# EAGLE board CurrentController (EAGLE 6.6.0)
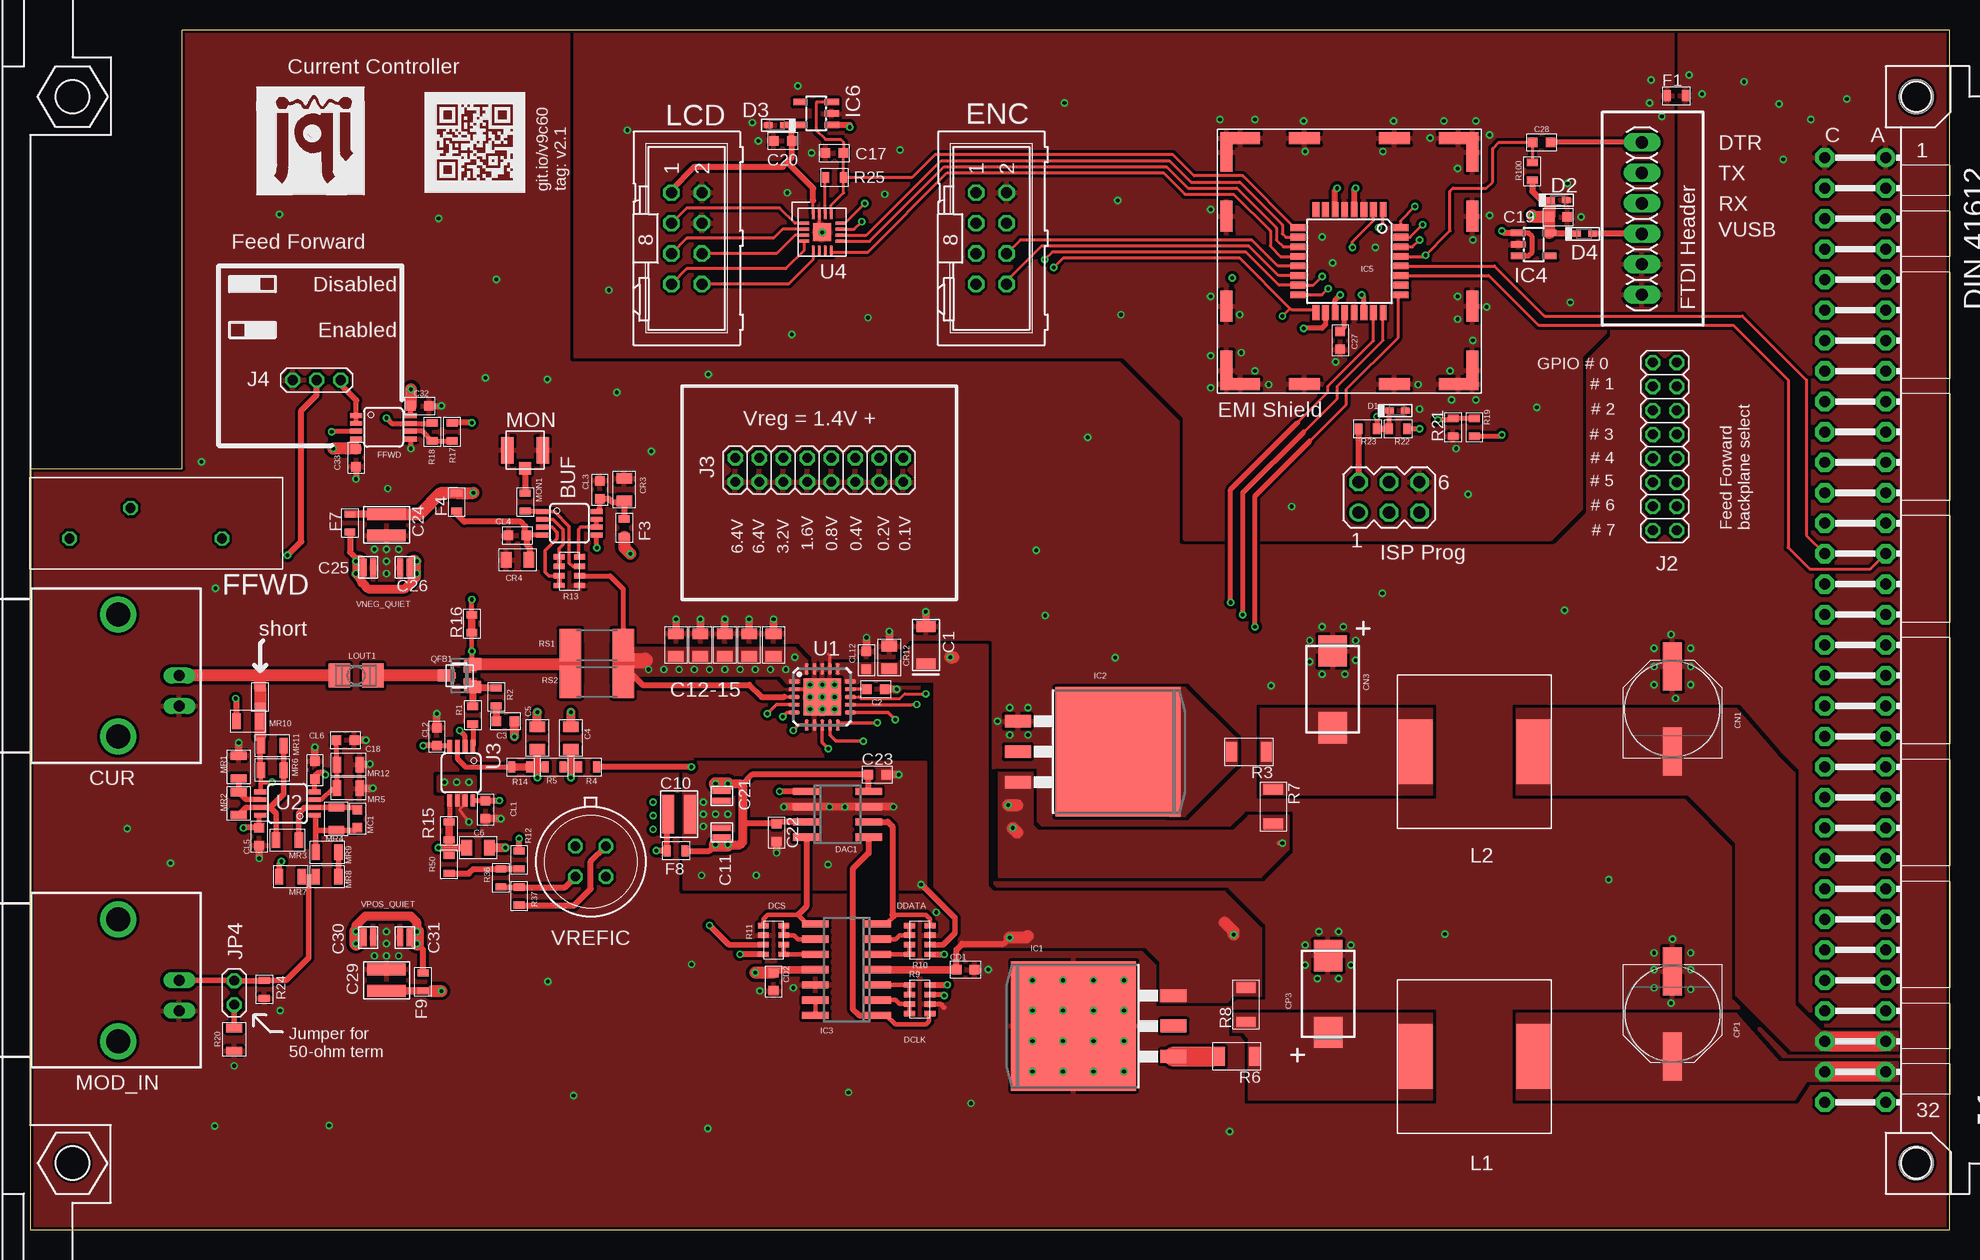
[diagram p5: board, top side]
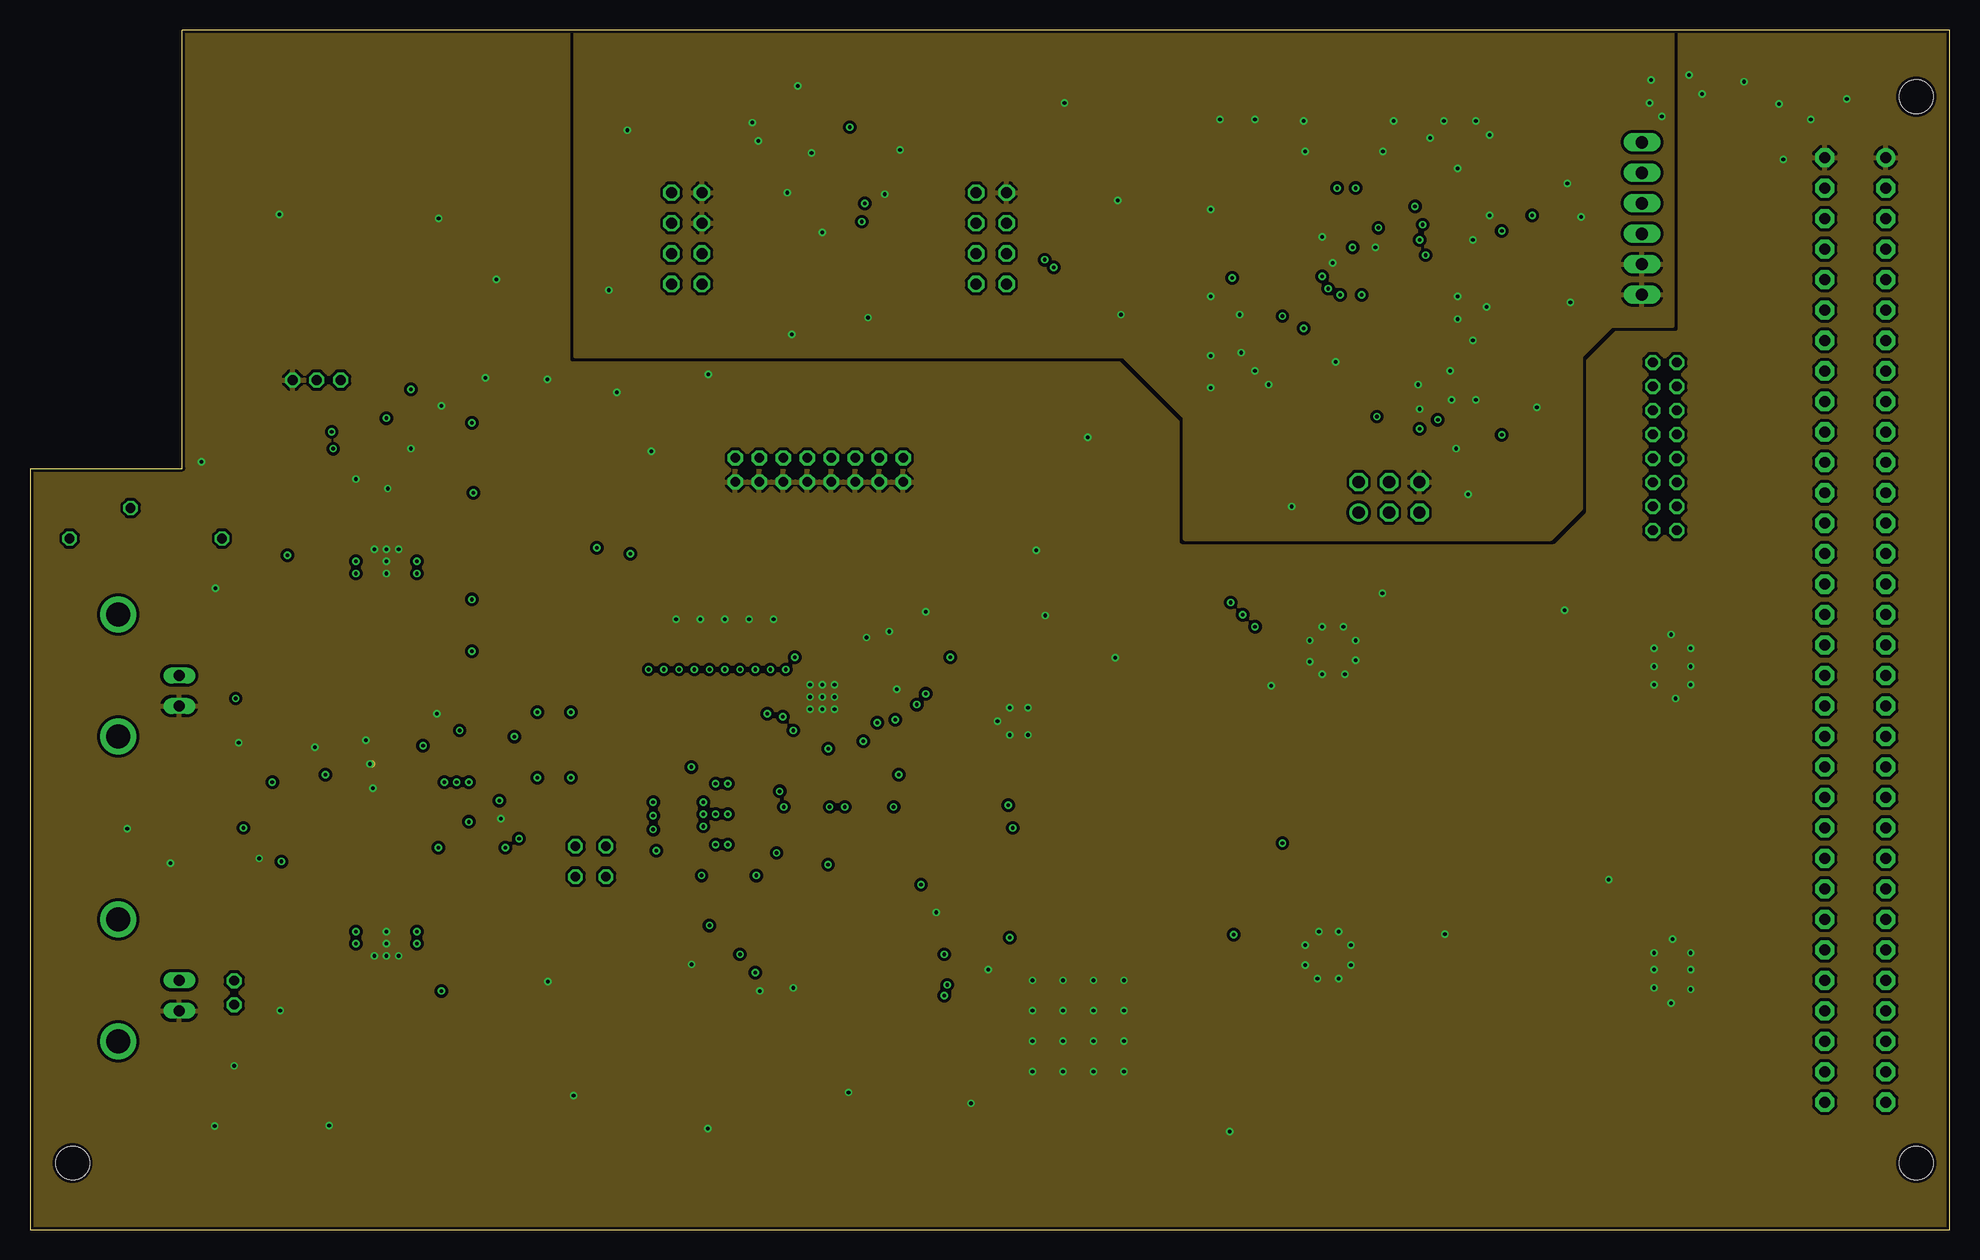
[diagram p6: board, inner layer Route2]
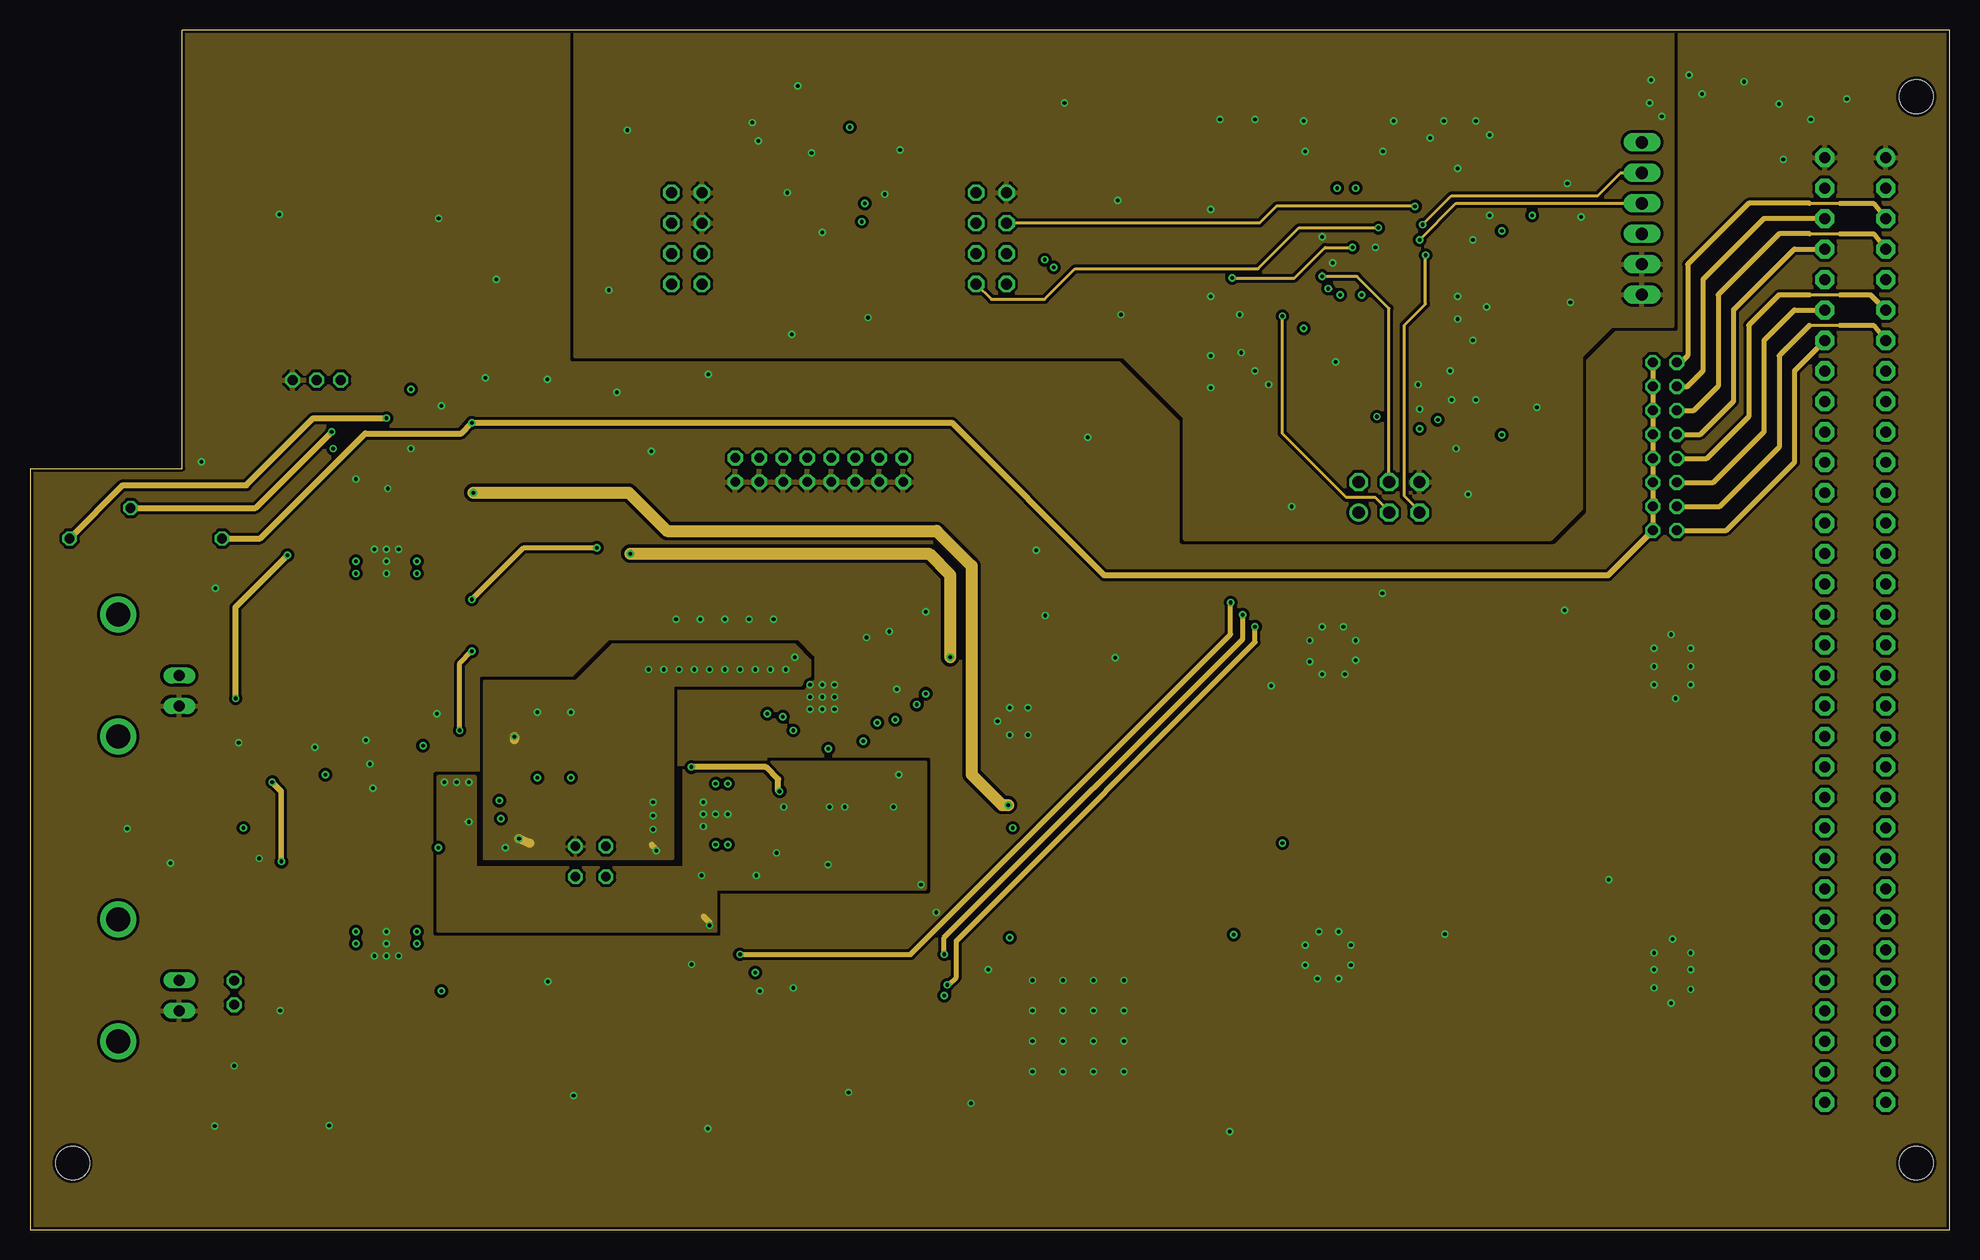
[diagram p7: board, inner layer Route15]
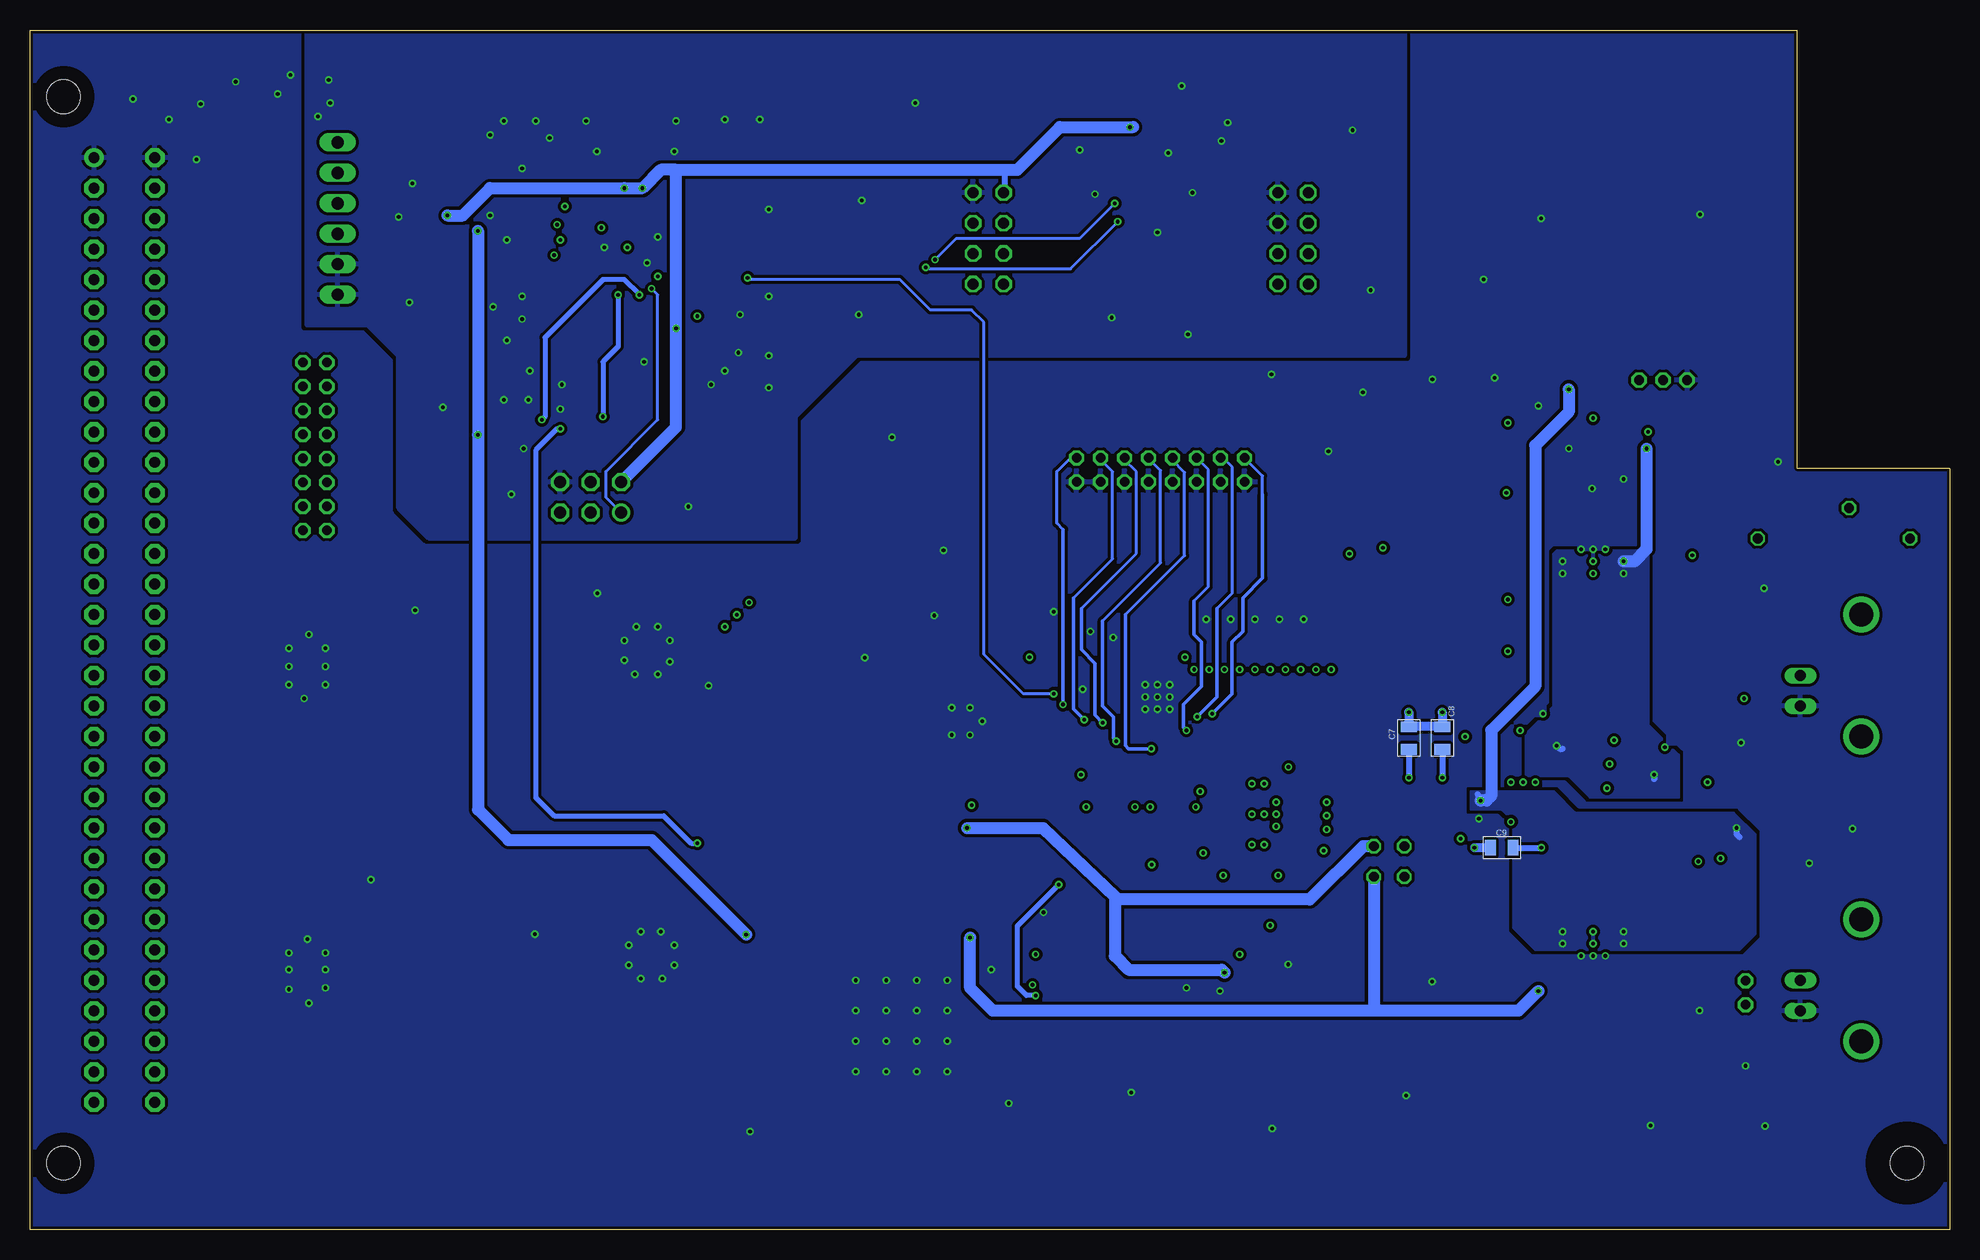
[diagram p8: board, bottom side, seen from below]

Size 160.02 x 100.03 mm. Coordinates in mm from the lower left corner, seen from the top.
Copper layers (1*2*15*16): Top 0.035mm / dielectric 0.23mm / Route2 0.035mm / dielectric 0.93mm / Route15 0.035mm / dielectric 0.23mm / Bottom 0.035mm
Design rules "MF_Standard_4_Layer": minimum track width 5mil, minimum drill 12mil, track to track 5mil, track to pad 5mil, pad to pad 5mil, via to via 5mil, smd to smd 0mil, copper to edge 10mil, drill to drill 10mil, minimum pad ring 6mil, minimum via ring 6mil, stop-mask expansion 2mil, vias tented up to drill 25mil, thermal gap 10mil

## Footprints (pad centres in the part's own frame; a part is rotated, then mirrored left to right if it is on the bottom)
MSOP08 = smd 0.4 x 1: 1 -0.976,-2.263; 2 -0.326,-2.263; 3 0.324,-2.263; 4 0.974,-2.263; 5 0.974,2.262; 6 0.324,2.262; 7 -0.326,2.262; 8 -0.976,2.262
C_POL_1206 = smd 0.9 x 1.6: P$1 -1.55,0; P$2 1.55,0
C_MLCC_0603 = smd 0.8 x 0.8: P$1 -0.75,0; P$2 0.75,0
C_MLCC_0805 = smd 0.9 x 1.3: P$1 -0.95,0; P$2 0.95,0
C_MLCC_0612 = smd 1 x 3.2: P$1 -0.9,0; P$2 0.9,0
C_MLCC_0306 = smd 0.5 x 1.5: P$1 -0.4,0; P$2 0.4,0
PANASONIC_F = smd 4 x 1.6: + 3.55,0; - -3.55,0
CT7343 = smd 2.6 x 2.4: + -3.2,0; - 3.2,0
BNC90 = drill 0.9 pad 1.27 long: 1 0,-5.08; 2 -2.54,-5.08 | drill 2 pad 2.032: ANCHOR1 -5.08,0; ANCHOR2 5.08,0
SOD523 = smd 0.7 x 0.5: A 0.7,0; C -0.6,0
SOIC-8 = smd 0.6 x 2.2: 1 -1.905,-2.6; 2 -0.635,-2.6; 3 0.635,-2.6; 4 1.905,-2.6; 5 1.905,2.6; 6 0.635,2.6; 7 -0.635,2.6; 8 -1.905,2.6
ML08 = drill 0.914 octagon: 1 -3.81,-1.143; 2 -3.81,1.397; 3 -1.27,-1.143; 4 -1.27,1.397; 5 1.27,-1.143; 6 1.27,1.397; 7 3.81,-1.143; 8 3.81,1.397
L_FERRITE_0603 = smd 0.6 x 0.9: P$1 -0.75,0; P$2 0.75,0
TO263-3 = smd 1.067 x 2.159: 1 -2.54,-5.791; 2 0,-5.791; 3 2.54,-5.791 | smd 10.8 x 10.41: TAB 0,2.54
TO223-3 = smd 1.067 x 2.159: 1 -2.54,-7.061; 2 0,-7.061; 3 2.54,-7.061 | smd 10.8 x 10.41: TAB 0,1.27
SO14 = smd 0.6 x 2.2: 1 -3.81,-2.6; 2 -2.54,-2.6; 3 -1.27,-2.6; 4 0,-2.6; 5 1.27,-2.6; 6 2.54,-2.6; 7 3.81,-2.6; 8 3.81,2.6; 9 2.54,2.6; 10 1.27,2.6; 11 0,2.6; 12 -1.27,2.6; 13 -2.54,2.6; 14 -3.81,2.6
SOT23-5L = smd 0.55 x 1.2: 1 -0.95,-1.3; 2 0,-1.3; 3 0.95,-1.3; 4 0.95,1.3; 5 -0.95,1.3
TQFP32-08 = smd 1.27 x 0.559: 1 -4.293,2.8; 2 -4.293,2; 3 -4.293,1.2; 4 -4.293,0.4; 5 -4.293,-0.4; 6 -4.293,-1.2; 7 -4.293,-2; 8 -4.293,-2.8; 17 4.293,-2.8; 18 4.293,-2; 19 4.293,-1.2; 20 4.293,-0.4; 21 4.293,0.4; 22 4.293,1.2; 23 4.293,2; 24 4.293,2.8 | smd 0.559 x 1.27: 9 -2.8,-4.293; 10 -2,-4.293; 11 -1.2,-4.293; 12 -0.4,-4.293; 13 0.4,-4.293; 14 1.2,-4.293; 15 2,-4.293; 16 2.8,-4.293; 25 2.8,4.293; 26 2,4.293; 27 1.2,4.293; 28 0.4,4.293; 29 -0.4,4.293; 30 -1.2,4.293; 31 -2,4.293; 32 -2.8,4.293
SOT323 = smd 0.5 x 1: 1 -0.65,-0.9; 2 0.65,-0.9; 3 0,0.9
SC-89 = smd 0.5 x 0.6: P$1 -0.5,-0.65; P$2 0.5,-0.65; P$3 0,0.65
VG64-CUTOUT = drill 0.914 pad 1.6: A1 154.94,35.56 | drill 0.914 pad 1.6 octagon: A2 154.94,33.02; A3 154.94,30.48; A4 154.94,27.94; A5 154.94,25.4; A6 154.94,22.86; A7 154.94,20.32; A8 154.94,17.78; A9 154.94,15.24; A10 154.94,12.7; A11 154.94,10.16; A12 154.94,7.62; A13 154.94,5.08; A14 154.94,2.54; A15 154.94,0; A16 154.94,-2.54; A17 154.94,-5.08; A18 154.94,-7.62; A19 154.94,-10.16; A20 154.94,-12.7; A21 154.94,-15.24; A22 154.94,-17.78; A23 154.94,-20.32; A24 154.94,-22.86; A25 154.94,-25.4; A26 154.94,-27.94; A27 154.94,-30.48; A28 154.94,-33.02; A29 154.94,-35.56; A30 154.94,-38.1; A31 154.94,-40.64; A32 154.94,-43.18; C1 149.86,35.56; C2 149.86,33.02; C3 149.86,30.48; C4 149.86,27.94; C5 149.86,25.4; C6 149.86,22.86; C7 149.86,20.32; C8 149.86,17.78; C9 149.86,15.24; C10 149.86,12.7; C11 149.86,10.16; C12 149.86,7.62; C13 149.86,5.08; C14 149.86,2.54; C15 149.86,0; C16 149.86,-2.54; C17 149.86,-5.08; C18 149.86,-7.62; C19 149.86,-10.16; C20 149.86,-12.7; C21 149.86,-15.24; C22 149.86,-17.78; C23 149.86,-20.32; C24 149.86,-22.86; C25 149.86,-25.4; C26 149.86,-27.94; C27 149.86,-30.48; C28 149.86,-33.02; C29 149.86,-35.56; C30 149.86,-38.1; C31 149.86,-40.64; C32 149.86,-43.18 | hole 2.794: 3.81,-48.26; 157.48,40.64; 157.48,-48.26
2X8_LOW_PROFILE_JUMPER_MATRIX = drill 0.8 pad 1.27 octagon: P$1 -7,-1; P$2 -7,1; P$3 -5,-1; P$4 -5,1; P$5 -3,-1; P$6 -3,1; P$7 -1,-1; P$8 -1,1; P$9 1,-1; P$10 1,1; P$11 3,-1; P$12 3,1; P$13 5,-1; P$14 5,1; P$15 7,-1; P$16 7,1
1X3_LOW_PROFILE = drill 0.8 pad 1.27 octagon: P1 0,1; P2 0,-1; P3 0,-3
1X06 = drill 1.016 long: 1 -6.35,0; 2 -3.81,0; 3 -1.27,0; 4 1.27,0; 5 3.81,0; 6 6.35,0
1X2_LOW_PROFILE = drill 0.8 pad 1.27 octagon: 1 0,-1; 2 0,1
WURTH_1280 = smd 5.4 x 2.9: P$1 0,4.95; P$2 0,-4.95
L3225P = smd 1.8 x 2: 1 -1.4,0; 2 1.4,0
UMC = smd 1.041 x 0.991: P$1 1.511,0 | smd 2.21 x 1.041: P$2 0,1.473; P$3 0,-1.473
R_0603 = smd 0.6 x 0.9: P$1 -0.75,0; P$2 0.75,0
R_0805 = smd 0.7 x 1.3: P$1 -0.95,0; P$2 0.95,0
SOT-23 = smd 1 x 1.4: 1 -0.95,-1.1; 2 0.95,-1.1; 3 0,1.1
R_1206 = smd 0.9 x 1.6: P$1 -1.45,0; P$2 1.45,0
742_ARRAY = smd 0.45 x 0.9: P$1 0,0.85; P$2 0,-0.85; P$3 0.8,0.85; P$4 0.8,-0.85; P$5 1.6,0.85; P$6 1.6,-0.85; P$7 2.4,0.85; P$8 2.4,-0.85
R2010 = smd 1.8 x 2.7: 1 -2.2,0; 2 2.2,0
MA03-2 = drill 1.016: 1 -2.54,-1.27 | drill 1.016 octagon: 2 -2.54,1.27; 3 0,-1.27; 4 0,1.27; 5 2.54,-1.27; 6 2.54,1.27
3006P = drill 0.8 octagon: P$1 -2.54,-7.62; P$2 0,0; P$3 -2.54,5.08
S-PVQFN-N20 = smd 0.9 x 0.3: 1 -2.35,1.3; 2 -2.35,0.65; 3 -2.35,0; 4 -2.35,-0.65; 5 -2.35,-1.3; 11 2.35,-1.3; 12 2.35,-0.65; 13 2.35,0; 14 2.35,0.65; 15 2.35,1.3 | smd 0.3 x 0.9: 6 -1.3,-2.35; 7 -0.65,-2.35; 8 0,-2.35; 9 0.65,-2.35; 10 1.3,-2.35; 16 1.3,2.35; 17 0.65,2.35; 18 0,2.35; 19 -0.65,2.35; 20 -1.3,2.35 | smd 3.1 x 3.1: EXP 0,0
HVQFN16 = smd 0.9 x 0.24: 1 -1.55,0.75; 2 -1.55,0.25; 3 -1.55,-0.25; 4 -1.55,-0.75; 9 1.55,-0.75; 10 1.55,-0.25; 11 1.55,0.25; 12 1.55,0.75 | smd 0.24 x 0.9: 5 -0.75,-1.55; 6 -0.25,-1.55; 7 0.25,-1.55; 8 0.75,-1.55; 13 0.75,1.55; 14 0.25,1.55; 15 -0.25,1.55; 16 -0.75,1.55 | smd 1.5 x 1.5: P$17 0,0
WURTH_SHIELD = smd 1 x 2.6: P$1 -10.25,3.75; P$2 -10.25,-3.75; P$3 10.25,3.75; P$4 10.25,-3.75 | smd 2.6 x 1: P$5 -3.75,-10.25; P$6 3.75,-10.25; P$7 3.75,10.25; P$8 -3.75,10.25 | smd 1 x 3.3: P$9 -10.25,-9.1; P$12 10.25,-9.1; P$13 10.25,9.1; P$16 -10.25,9.1 | smd 3.3 x 1: P$10 -9.1,-10.25; P$11 9.1,-10.25; P$14 9.1,10.25; P$15 -9.1,10.25
TO39/4 = drill 0.813 octagon: 1 -1.27,-1.27; 2 1.27,-1.27; 3 1.27,1.27; 4 -1.27,1.27

## Placement (x,y rotation side)
BUF  AD8676  [MSOP08]  44.96,58.9 270 top
C1  47uF  [C_POL_1206]  74.68,48.74 90 top
C2  1uF  [C_MLCC_0603]  70.51,45.07 0 top
C3  8.2nF  [C_MLCC_0603]  39.62,42.39 180 top
C4  22uF  [C_MLCC_0805]  45.09,41 270 top
C5  22uF  [C_MLCC_0805]  42.29,41 270 top
C6  22uF  [C_MLCC_0805]  37.34,31.85 180 top
C7  22uF  [C_MLCC_0805]  45.09,41 270 bottom
C8  22uF  [C_MLCC_0805]  42.29,41 270 bottom
C9  22uF  [C_MLCC_0805]  37.34,31.85 0 bottom
C10  0.47uF  [C_MLCC_0612]  54.1,34.65 0 top
C11  10nF  [C_MLCC_0306]  57.66,33.12 90 top
C12  10uF  [C_MLCC_0805]  61.98,48.74 90 top
C13  10uF  [C_MLCC_0805]  59.94,48.74 90 top
C14  10uF  [C_MLCC_0805]  57.91,48.74 90 top
C15  10uF  [C_MLCC_0805]  55.88,48.74 90 top
C16  10uF  [C_MLCC_0805]  53.85,48.74 90 top
C17  100nF  [C_MLCC_0603]  67.06,89.76 180 top
C18  1uF  [C_MLCC_0603]  26.29,40.82 180 top
C19  1uF  [C_MLCC_0603]  127.38,84.43 0 top
C20  1uF  [C_MLCC_0603]  62.74,90.78 180 top
C21  10nF  [C_MLCC_0306]  57.66,36.17 270 top
C22  100nF  [C_MLCC_0603]  62.23,33.12 270 top
C23  100nF  [C_MLCC_0603]  70.61,37.95 0 top
C24  0.47uF  [C_MLCC_0612]  29.72,58.78 270 top
C25  10nF  [C_MLCC_0306]  28.19,55.22 0 top
C26  10nF  [C_MLCC_0306]  31.24,55.22 180 top
C27  100nF  [C_MLCC_0603]  109.22,74.14 270 top
C28  100nF  [C_MLCC_0603]  125.98,90.65 180 top
C29  0.47uF  [C_MLCC_0612]  29.72,20.8 90 top
C30  10nF  [C_MLCC_0306]  28.19,24.36 0 top
C31  10nF  [C_MLCC_0306]  31.24,24.36 180 top
C32  100nF  [C_MLCC_0603]  32.51,68.68 0 top
C33  100nF  [C_MLCC_0603]  27.18,64.36 90 top
CD1  100nF  [C_MLCC_0603]  77.98,21.69 0 top
CD2  100nF  [C_MLCC_0603]  61.98,20.68 270 top
CL1  100nF  [C_MLCC_0603]  37.97,35.03 270 top
CL2  100nF  [C_MLCC_0603]  33.91,41.12 90 top
CL3  100nF  [C_MLCC_0603]  47.5,61.7 90 top
CL4  100nF  [C_MLCC_0603]  40.64,57.89 180 top
CL5  100nF  [C_MLCC_0603]  19.1,32.79 270 top
CL6  100nF  [C_MLCC_0603]  23.75,38.33 90 top
CL12  100nF  [C_MLCC_0603]  69.72,47.47 90 top
CN1  220uF  [PANASONIC_F]  136.91,43.41 90 top
CN3  47uF  [CT7343]  108.58,45.06 270 top
CP1  220uF  [PANASONIC_F]  136.91,18.01 270 top
CP3  47uF  [CT7343]  108.2,19.66 90 top
CR3  10uF  [C_MLCC_0805]  49.53,61.7 90 top
CR4  10uF  [C_MLCC_0805]  40.64,55.85 180 top
CR12  10uF  [C_MLCC_0805]  71.63,47.73 90 top
CUR  BNC-H  [BNC90]  7.37,46.2 90 top
D1  Schottky  [SOD523]  113.92,68.3 0 top
D2  Schottky  [SOD523]  127.36,85.83 0 top
D3  Schottky  [SOD523]  62.26,92.1 180 top
D4  Schottky  [SOD523]  129.54,83.03 0 top
DAC1  AD5541  [SOIC-8]  67.31,34.65 270 top
ENC  [ML08]  80.01,82.65 270 top
F1  1k_ferrite  [L_FERRITE_0603]  137.24,94.54 0 top
F3  1k_ferrite  [L_FERRITE_0603]  49.53,58.52 270 top
F4  1k_ferrite  [L_FERRITE_0603]  35.56,60.68 90 top
F7  1k_ferrite  [L_FERRITE_0603]  26.67,58.93 270 top
F8  1k_ferrite  [L_FERRITE_0603]  53.85,31.6 0 top
F9  1k_ferrite  [L_FERRITE_0603]  32.77,20.66 90 top
FFWD  AD8676  [MSOP08]  29.46,66.9 270 top
IC1  LM340S-12  [TO263-3]  89.53,16.99 90 top
IC2  L7912  [TO223-3]  89.41,39.85 270 top
IC3  TS514  [SO14]  68.07,21.69 90 top
IC4  MIC5205-5V  [SOT23-5L]  125.35,82.14 270 top
IC5  MEGA8-AI  [TQFP32-08]  109.98,80.75 270 top
IC6  MIC5205-3V  [SOT23-5L]  65.53,93.07 90 top
IC7  PMOS-SOT323  [SOT323]  35.81,46.2 90 top
IC8  PMOS-SOT323-SC89  [SC-89]  35.81,46.2 90 top
J1  [VG64-CUTOUT]  -0.25,53.82 0 top
J2  2X8_LOW_PROFILE_JUMPER  [2X8_LOW_PROFILE_JUMPER_MATRIX]  136.27,65.3 270 top
J3  2X8_LOW_PROFILE_JUMPER  [2X8_LOW_PROFILE_JUMPER_MATRIX]  65.79,63.35 0 top
J4  1X3_LOW_PROFILE_JUMPER  [1X3_LOW_PROFILE]  24.89,70.84 270 top
JP1  [1X06]  134.37,84.3 90 top
JP4  1X2_LOW_PROFILE_JUMPER  [1X2_LOW_PROFILE]  17.02,19.76 180 top
L1  100uH  [WURTH_1280]  120.4,14.45 270 top
L2  100uH  [WURTH_1280]  120.4,39.85 270 top
LCD  [ML08]  54.61,82.65 270 top
LOUT1  100uH  [L3225P]  27.18,46.2 180 top
MC1  1uF  [C_MLCC_0603]  27.3,34.26 270 top
MOD_IN  BNC-H  [BNC90]  7.37,20.8 90 top
MON  UMC  [UMC]  41.28,65 270 top
MON1  100R  [R_0603]  41.28,60.68 90 top
MR1  1k  [R_0805]  17.4,38.58 270 top
MR2  1k  [R_0805]  17.4,35.53 90 top
MR3  1k  [R_0805]  21.46,32.49 180 top
MR4  1k  [R_0805]  25.53,34.26 90 top
MR5  1k  [R_0805]  26.54,36.8 0 top
MR6  1k  [R_0805]  20.19,38.33 180 top
MR7  1k  [R_0805]  21.72,29.44 0 top
MR8  1k  [R_0805]  24.76,29.44 0 top
MR9  1k  [R_0805]  24.76,31.47 180 top
MR10  1k  [R_0805]  18.16,42.39 0 top
MR11  1k  [R_0805]  20.19,40.36 180 top
MR12  1k  [R_0805]  26.54,38.79 0 top
QFB1  NDS0605  [SOT-23]  35.81,46.2 90 top
R1  10k  [R_0603]  36.91,42.9 90 top
R2  100R  [R_0603]  38.86,44.42 270 top
R3  0R  [R_1206]  101.6,39.85 180 top
R4  3k  [R_0603]  46.48,38.58 0 top
R5  3k  [R_0603]  43.69,38.58 0 top
R6  0R  [R_1206]  100.58,14.45 180 top
R7  0R  [R_1206]  103.63,35.28 270 top
R8  0R  [R_1206]  101.35,18.77 90 top
R9  10k  [742_ARRAY]  74.17,20.42 270 top
R10  10k  [742_ARRAY]  74.17,22.96 90 top
R11  10k  [742_ARRAY]  61.98,22.96 90 top
R12  28.7k  [R_0603]  40.77,30.84 90 top
R13  10k  [742_ARRAY]  44.96,56.11 270 top
R14  [R_0603]  40.89,38.58 0 top
R15  [R_0603]  34.93,33.25 270 top
R16  [R_0603]  36.83,50.52 90 top
R17  10k  [R_0603]  35.18,66.52 270 top
R18  10k  [R_0603]  33.53,66.52 90 top
R19  28.7k  [R_0603]  120.4,66.9 270 top
R20  50R  [R_0805]  17.02,15.88 90 top
R21  3k  [R_0603]  118.62,66.9 90 top
R22  28.7k  [R_0603]  114.05,66.78 180 top
R23  3k  [R_0603]  111.51,66.78 180 top
R24  10k  [R_0603]  19.53,20.04 90 top
R25  200k  [R_0603]  67.06,87.73 0 top
R36  11k  [R_0603]  39.24,29.34 90 top
R37  7.5k  [R_0603]  40.77,27.81 90 top
R50  3k  [R_0603]  34.93,30.45 270 top
R100  10k  [R_0603]  125.22,88.24 270 top
RJH1  0R_DNP  [R_0603]  19.18,44.42 270 top
RS1  66R  [R2010]  47.24,48.74 0 top
RS2  66R  [R2010]  47.24,45.69 0 top
SV1  [MA03-2]  113.28,61.06 0 top
T1  100k  [3006P]  8.38,60.17 90 top
U1  TPS7A470  [S-PVQFN-N20]  66.04,44.42 0 top
U2  AD8676  [MSOP08]  21.46,35.53 90 top
U3  AD8676  [MSOP08]  35.94,38.07 180 top
U4  NT2006  [HVQFN16]  66.04,83.16 0 top
U$4  [JQI_LOGO_NEGATIVE-SILKSCREEN]  18.92,86.33 0 top
U$5  WURTH_EMI  [WURTH_SHIELD]  109.98,80.75 0 top
U$6  [QR-HTTPS://GIT.IO/V9C60-LIGHT-SILK]  37.08,90.65 0 top
VREFIC  LM399H  [TO39/4]  46.74,30.71 270 top

## Tracks (layer width: path | path; a pad name or v marks a point on that pad's centre or on a via)
+3V
  Top 0.254: U4.16 65.29,85.81
  Top 0.508: IC6.5 63.5,92.12 | 63.5,92.12 62.87,92.12 D3.C | 63.5,92.12 63.49,92.1 C20.P$1 63.5,90.77 63.5,89.38 63.12,89 | LCD.1 53.47,86.72 55.37,88.62 62.74,88.62 63.12,89 | 65.29,85.81 65.29,86.83 63.12,89
+15V
  Top 1.651: J1.A31 J1.C31
  pour Top (isolate 0.254, no thermals): 155.7,12.42 148.08,12.42 147.07,10.9 123.95,10.9 123.95,18.01 142.24,18.01 145.8,13.94 155.7,13.94
-15V
  Top 1.651: J1.C30 J1.A30
  pour Top (isolate 0.254, no thermals): 155.7,14.96 146.81,14.96 142.24,19.53 142.24,32.23 138.18,36.3 123.95,36.3 123.95,43.41 142.24,43.41 145.54,39.6 147.07,38.07 147.07,18.77 149.35,16.48 155.7,16.48
-FFWD  (via drill 0.3)
  Top 0.406: R18.P$2 33.36,67.23 FFWD.7 30.15,67.23 v29.72,67.67
  Route15 0.508: T1.P$3 7.75,62.08 18.03,62.08 23.62,67.67 v29.72,67.67
A6  (via drill 0.3)
  Top 0.406: IC5.19 108.78,77.51 v109.22,77.95 | v117.35,67.54 118.5,67.54 R21.P$2 R19.P$1
  Bottom 0.406: v109.22,77.95 110.49,79.22 112.27,79.22 117.09,74.4 117.09,67.79 v117.35,67.54
A7  (via drill 0.3)
  Top 0.406: IC5.22 111.18,77.77 v111,77.95 | v112.27,67.79 112.27,66.79 R23.P$1 | R22.P$2 113.3,68.28 D1.C
  Top 0.508: R23.P$1 R22.P$2
  Bottom 0.406: v111,77.95 111,73.63 112.27,72.36 v112.27,67.79
CURR_OUT
  Top 0.381: RJH1.P$1 19.18,45.06
  Top 1.016: LOUT1.2 19.18,46.2 | 19.18,46.2 CUR.1 | 19.18,46.2 RJH1.P$1 19.18,41.12
DAC_CS  (via drill 0.3)
  Top 0.254: 105.66,67.28 108.2,69.82 108.2,70.33 111.98,74.11 IC5.23
  Top 0.406: v100.08,52.3 100.08,61.7 105.66,67.28
  Top 0.508: R11.P$1 v59.18,22.96
  Route15 0.406: v59.18,22.96 73.41,22.96 100.08,49.63 v100.08,52.3
DAC_MOSI  (via drill 0.3)
  Top 0.254: 106.17,66.52 108.97,69.32 108.97,70.33 112.78,74.15 IC5.24
  Top 0.406: v101.09,51.28 101.09,61.44 106.17,66.52
  Top 0.508: R10.P$2 v76.2,22.96
  Route15 0.406: v76.2,22.96 76.2,24.36 101.09,49.25 v101.09,51.28
DAC_SCK  (via drill 0.3)
  Top 0.254: 106.68,65.76 109.73,68.81 109.73,70.08 114.05,74.4 114.05,77.72 IC5.25
  Top 0.406: v102.11,50.27 102.11,61.19 106.68,65.76
  Top 0.508: R9.P$1 v76.45,20.42
  Route15 0.406: v76.45,20.42 76.58,20.42 77.22,21.06 77.22,24.1 102.11,49 v102.11,50.27
DACG  (via drill 0.3)
  Top 0.254: U3.7 36.27,35.48 35.81,35.03 v36.58,34.01
  Top 0.406: R9.P$3 76.11,19.62 v76.2,19.53
  Top 0.457: R10.P$4 76.11,23.76 77.09,24.74 77.09,26.01 74.42,28.68 | R11.P$3 58.26,23.76 v56.64,25.37
  Top 0.61: v71.98,35.26 71.96,35.28 DAC1.7 67.94,35.28 v67.92,35.26 v66.65,35.26 66.62,35.28 DAC1.2 62.87,35.28 v62.84,35.26 | C22.P$2 v62.23,31.42 | C23.P$2 v72.41,37.95
  Route15 0.254: v36.58,34.01 36.32,34.01
  Route15 0.457: v56.64,25.37 56.64,25.63 56.13,26.14
  Bottom 0.406: v76.2,19.53 76.96,19.53 77.72,20.29 77.72,25.32 v74.27,28.78
  other vias: 57.15,34.65 58.17,34.65 56.13,35.66 56.13,34.65 56.13,33.63 35.56,37.31 36.58,37.31 34.54,37.31 66.52,30.43 60.55,29.54 55.98,29.54
  pour Route15 (isolate 0.254): 34.04,37.82 37.08,37.82 37.08,30.2 57.15,30.2 57.15,24.87 34.04,24.87
  pour Top (isolate 0.254, no thermals): 34.04,37.82 37.08,37.82 37.08,33.5 35.31,33.5 35.31,36.55 34.04,36.55
  pour Route15 (isolate 0.254): 54.48,36.3 54.48,28.42 74.68,28.42 74.68,38.96 54.48,38.96 54.48,36.42
  pour Top (isolate 0.254, no thermals): 54.48,38.96 54.48,28.42 74.68,28.42 74.68,38.96
DC_OUT
  Top 0.254: IC8.P$3 IC7.3 QFB1.3
  Top 1.016: QFB1.3 LOUT1.1
DCLK
  Top 0.381: IC3.1 71.37,17.88 72.14,17.12 74.68,17.12 74.93,17.37 74.93,17.93 R9.P$7
  Top 0.508: DAC1.5 69.91,31.4 68.58,30.07 68.58,18.39 69.09,17.88 IC3.1
DCS
  Top 0.381: R11.P$7 61.13,25.92 61.47,26.26 64.01,26.26 64.77,25.5 IC3.8
  Top 0.508: DAC1.4 64.71,26.97 64.01,26.26
DDATA
  Top 0.381: R10.P$8 75.02,25.92 74.68,26.26 72.14,26.26 72.01,26.14 71.37,25.5 IC3.7
  Top 0.508: DAC1.6 71.5,34.01 71.88,33.63 71.88,26.26 72.01,26.14
DTR
  Top 0.406: JP1.6 C28.P$1
ENC_A
  Top 0.254: IC5.14 104.07,79.55 101.6,82.02 84.33,82.02 81.41,79.1 ENC.8
ENC_B
  Top 0.254: IC5.13 104.03,80.35 101.85,82.52 82.55,82.52 ENC.6 81.53,81.51
ENC_SW  (via drill 0.3)
  Top 0.254: IC5.32 114.27,84.15 v115.44,85.32
  Route15 0.254: v115.44,85.32 103.89,85.32 102.49,83.92 ENC.4
FEED_FWD  (via drill 0.3)
  Top 0.508: MR10.P$1 17.21,44.23 v17.14,44.3 | v21.46,56.24 22.61,57.38 22.61,68.3 23.89,69.59 J4.P2
  Route15 0.508: v17.14,44.3 17.14,51.92 v21.46,56.24
FFWD  (via drill 0.3)
  Top 0.508: v36.83,67.28 35.19,67.28 R17.P$1
  Route15 0.406: J2.P$1 J2.P$3 J2.P$5 J2.P$7 J2.P$9 J2.P$11 135.27,60.97 135.48,60.76 135.48,60.52 J2.P$13 J2.P$15
  Route15 0.508: T1.P$1 19.18,57.63 27.94,66.4 35.94,66.4 v36.83,67.28 76.83,67.28 89.53,54.58 131.55,54.58 J2.P$15
FFWD_POSTGAIN
  Top 0.406: FFWD.2 FFWD.1 27.2,69.17
  Top 0.508: 27.2,69.17 25.89,70.48 J4.P1
GND  (via drill 0.3)
  Top 0.254: U1.17 66.69,47.84 66.55,47.98
  Top 0.305: U1.2 64.66,45.07 v65.02,45.44
  Top 0.406: FFWD.5 31.73,65.15 v31.75,65.13 | R9.P$5 75.89,18.82 76.2,18.52
  Top 0.508: C32.P$2 v34.29,68.68 | C33.P$1 v27.18,62.59
  Top 0.61: CL1.P$2 39.23,34.28 v39.24,34.26 | CL6.P$2 v23.75,40.23 | C18.P$1 v27.99,40.82 | MR5.P$2 v28.57,36.8 | CL2.P$2 v33.91,43.03 | CL5.P$2 v19.1,30.96 | MR1.P$1 v17.4,40.61 | C16.P$2 v53.85,50.9 | v55.88,50.9 C15.P$2 | C14.P$2 v57.91,50.9 | C13.P$2 v59.94,50.9 | C12.P$2 v61.98,50.9 | CL12.P$2 v69.72,49.38 | CR12.P$2 v71.63,49.89 | C1.P$2 v74.68,51.54 | C2.P$2 v72.26,45.07 | MR12.P$2 28.3,38.79 v28.35,38.84
  Route2 0.61: v28.35,38.84 28.5,38.84
  other vias: 66.04,45.44 67.06,45.44 65.02,44.42 66.04,44.42 67.06,44.42 67.06,43.41 66.04,43.41 65.02,43.41 30.73,56.74 29.72,56.74 28.7,56.74 29.72,55.73 29.72,54.71 28.7,22.83 29.72,22.83 30.73,22.83 29.72,23.85 29.72,24.87 83.57,20.8 86.11,20.8 88.65,20.8 91.19,20.8 91.19,18.26 88.65,18.26 86.11,18.26 83.57,18.26 83.57,15.72 86.11,15.72 88.65,15.72 91.19,15.72 91.19,13.18 88.65,13.18 86.11,13.18 83.57,13.18 79.88,21.69 63.63,20.17 60.83,19.91 17.02,13.67 81.66,43.54 83.18,43.54 80.64,42.39 81.66,41.25 83.18,41.25 107.7,50.27 109.47,50.27 110.49,49.12 110.49,47.47 106.68,49.12 106.68,47.35 107.7,46.33 109.6,46.33 107.44,24.87 109.09,24.87 110.11,23.72 110.11,22.07 109.09,20.93 107.31,20.93 106.3,22.07 106.3,23.72 136.91,24.23 135.38,23.09 135.38,21.69 135.38,20.17 136.78,18.9 138.43,20.04 138.43,21.69 138.43,23.09 136.78,49.63 137.16,44.3 138.43,45.44 138.43,46.96 138.43,48.49 135.38,48.49 135.38,46.96 135.38,45.44 75.54,26.47 8.1,33.45 34.06,84.33 38.86,79.22 48.92,69.82 88.16,66.07 84.63,51.21 112.73,53.06 127.91,51.64 103.45,45.36 90.45,47.7 51.79,64.9 37.95,71.02 29.82,61.8 15.47,53.49 24.94,8.69 45.31,11.2 56.49,8.43 55.14,22.12 43.15,20.7 78.44,10.54 68.22,11.46 100,8.2 117.93,24.64 131.6,29.18 83.87,56.64 56.54,71.32 43.13,70.89 20.8,84.66 14.3,64.03 11.71,30.56 15.39,8.66 20.85,18.29 138.3,96.27 139.37,94.69 145.8,93.85 146.15,89.23 151.43,94.28 148.44,92.56 142.88,95.71
  pour Top (isolate 0.254, rank 2): -0.25,100.81 159.77,100.81 159.77,-0.79 -0.25,-0.79
  pour Route2 (isolate 0.254, rank 2): -0.25,100.81 159.77,100.81 159.77,-0.79 -0.25,-0.79
  pour Route15 (isolate 0.254, rank 2): -0.25,100.81 159.77,100.81 159.77,-0.79 -0.25,-0.79
  pour Bottom (isolate 0.254, rank 2): -0.25,100.81 159.77,100.81 159.77,-0.79 -0.25,-0.79
GPIO0
  Route15 0.254: 148.34,85.57 150.88,85.57
  Route15 0.406: J1.A3 153.67,85.57 150.88,85.57 | 148.34,85.57 143.26,85.57 138.18,80.49 138.18,72.87 137.61,72.3 J2.P$2
GPIO1
  Route15 0.406: J1.C3 144.53,84.3 139.45,79.22 139.45,71.6 138.15,70.3 J2.P$4
GPIO2
  Route15 0.254: 148.34,83.03 150.88,83.03
  Route15 0.406: J1.A4 153.67,83.03 150.88,83.03 | 148.34,83.03 145.8,83.03 140.72,77.95 140.72,70.33 138.69,68.3 J2.P$6
GPIO3
  Route15 0.406: J1.C4 147.07,81.76 141.99,76.68 141.99,69.06 139.23,66.3 J2.P$8
GPIO4
  Route15 0.254: 148.34,77.95 150.88,77.95
  Route15 0.406: J1.A6 153.42,77.95 150.88,77.95 | 148.34,77.95 145.8,77.95 143.26,75.41 143.26,67.79 139.77,64.3 J2.P$10
GPIO5
  Route15 0.406: J1.C6 147.07,76.68 144.53,74.14 144.53,66.52 140.31,62.3 J2.P$12
GPIO6
  Route15 0.254: 148.34,75.41 150.88,75.41
  Route15 0.406: J1.A7 153.67,75.41 150.88,75.41 | 148.34,75.41 145.8,72.87 145.8,65.25 140.85,60.3 J2.P$14
GPIO7
  Route15 0.406: J1.C7 147.07,71.6 147.07,63.98 141.39,58.3 J2.P$16
LCD_CS
  Top 0.254: U4.10 69.73,82.91 75.95,89.13 95,89.13 96.77,87.35 100.84,87.35 104.39,83.79 104.39,83.03 104.68,82.75 IC5.10
LCD_CS_3V
  Top 0.254: U4.3 63.76,82.91 62.23,81.38 LCD.6
LCD_EN
  Top 0.254: U4.13 66.79,85.43 67.82,86.46 67.82,87.72 R25.P$2 | R25.P$2 C17.P$1 67.82,89.78 67.82,90.65 67.56,90.91 66.29,90.91 65.53,91.67 65.53,93.95 65.59,94.02 IC6.3 | IC5.9 105.4,83.55 101.09,87.86 97.03,87.86 95.25,89.64 75.44,89.64 73.53,87.73 R25.P$2
LCD_MOSI_3V
  Top 0.254: U4.1 63.77,83.91 62.48,85.19 54.74,85.19 LCD.3
LCD_RS
  Top 0.254: U4.9 69.99,82.41 76.2,88.62 94.74,88.62 96.52,86.84 100.58,86.84 103.89,83.54 103.89,82.52 104.46,81.95 IC5.11
LCD_RS_3V
  Top 0.254: U4.4 64.52,82.38 64.52,81.64 62.99,80.11 54.74,80.11 LCD.7
LCD_RST
  Top 0.254: U4.8 66.89,81.51 69.85,81.51 76.45,88.11 94.49,88.11 96.27,86.33 100.33,86.33 103.38,83.29 103.38,82.02 104.25,81.15 IC5.12
LCD_RST_3V
  Top 0.254: U4.5 65.29,80.89 63.25,78.84 LCD.8
LCD_SCK_3V
  Top 0.254: U4.2 62.74,83.41 61.98,82.65 54.74,82.65 LCD.5
MISO  (via drill 0.3)
  Top 0.254: IC5.16 107.69,77.95 v108.2,78.46
  Route15 0.254: v108.2,78.46 108.46,78.46
  Bottom 0.254: SV1.1 112.01,61.06 112.01,63.22 107.69,67.54 107.69,77.95 v108.2,78.46
MOD_OUT  (via drill 0.3)
  Top 0.254: 19.24,36.55 U2.5
  Top 0.381: 19.24,36.55 19.24,37.31 | 19.24,37.31 MR6.P$2 19.18,38.39 | v20.19,37.31 19.24,37.31
  Top 0.406: MR11.P$2 19.18,40.36
  Top 0.457: MR7.P$1 20.77,30.52 v20.95,30.71 | 19.18,38.39 19.18,40.36 19.18,42.65
  Top 0.508: MR10.P$2 19.11,42.58 19.18,42.65 RJH1.P$2
  Route15 0.457: v20.95,30.71 20.95,36.55 v20.19,37.31
MODIN_B
  Top 0.457: MOD_IN.1 16.98,20.8 JP4.1 19.5,20.76 R24.P$2 21.38,20.79 21.38,20.82 23.24,22.68 23.24,28.8 | 23.27,29.36 23.24,29.36 23.24,29.44 MR7.P$2 MR8.P$1
  Top 0.508: 23.27,29.36 23.27,28.8 23.24,28.8
MON
  Top 0.305: BUF.1 43.73,59.88 44.96,58.65 44.96,55.6 45.25,55.31 R13.P$3
  Top 0.406: BUF.1 41.33,59.88 MON1.P$1
MON_MON
  Top 0.508: MON.P$1 MON1.P$2
MOSI  (via drill 0.3)
  Top 0.254: U4.12 67.93,83.91 v69.6,85.57 | v107.7,79.48 106.97,78.75 IC5.15 104.11,78.75 101.35,81.51 85.22,81.51 v84.58,80.87
  Route15 0.254: 107.7,79.73 v107.7,79.48 110.62,79.48 113.28,76.81 SV1.4
  Bottom 0.254: v69.6,85.57 72.52,82.65 82.8,82.65 v84.58,80.87
N$1
  Top 0.457: MR9.P$1 MR8.P$2
N$2
  Top 0.508: JP1.3 D4.A
N$3
  Top 0.381: IC3.9 64.01,24.23 63.68,24.56 R11.P$6 R11.P$8
N$4
  Top 0.305: BUF.6 45.9,58.58 45.72,58.39 45.72,56.2 R13.P$1
  Top 0.406: BUF.6 BUF.7
N$5
  Top 0.406: C27.P$1 109.58,75.25 IC5.20
N$6  (via drill 0.3)
  Top 0.406: R16.P$2 v36.83,52.55 | v47.24,56.87 47.22,56.89 BUF.5
  Top 0.61: R16.P$2 36.83,49.89
  Route15 0.406: v36.83,52.55 41.15,56.87 v47.24,56.87
N$7  (via drill 0.3)
  Top 0.406: v25.15,66.52 25.2,66.58 FFWD.3
  Route15 0.508: T1.P$2 18.8,60.17 v25.15,66.52
N$8  (via drill 0.3)
  Top 0.61: R4.P$1 45.09,38.58 | R5.P$2 45.09,38.58 | 45.09,38.58 v45.09,37.69 C7.P$2
  Bottom 0.508: C7.P$2 v45.09,37.69
N$9  (via drill 0.3)
  Top 0.61: R5.P$1 42.16,38.58 | 42.16,38.58 R14.P$2 | C8.P$2 v42.29,37.69 42.29,38.71 42.16,38.58
  Bottom 0.508: C8.P$2 v42.29,37.69
N$10
  Top 0.406: R1.P$1 U3.1
N$11
  Top 0.584: R1.P$2 QFB1.1 36.91,45.17 R2.P$1
  pour Top (no thermals): 36.17,45.95 36.17,44.81 37.24,44.81 37.24,45.95
N$12
  Top 0.406: U3.3 35.62,39.29 36.32,38.58 R14.P$1
  Top 0.61: R14.P$1 41.66,38.58
N$13
  Top 0.584: R2.P$2 C3.P$2
N$14
  Top 0.305: BUF.2 43.62,59.23 44.45,58.39 44.45,57.12 44.11,56.78 R13.P$2
  Top 0.406: R13.P$2 R13.P$4
N$15  (via drill 0.3)
  Top 0.381: R16.P$1 v36.83,48.23
  Top 0.406: U3.2 36.27,41.18 v35.81,41.63 | v36.83,48.23 36.83,47.24 QFB1.2
  Top 1.016: QFB1.2 45.04,47.15 45.04,47.22
  Top 1.778: RS2.1 45.04,47.22 RS1.1
  Route15 0.406: v35.81,41.63 35.81,47.22 v36.83,48.23
  pour Top (no thermals): 36.17,46.46 36.17,47.6 37.19,47.6 37.19,46.48 37.19,46.46
N$16
  Top 0.381: IC3.2 72.14,19.15 72.47,18.82 R9.P$6 R9.P$8
N$17
  Top 0.305: BUF.3 43.5,58.58 43.94,58.14 43.94,57.63 42.93,56.62 42.93,54.84 43.26,54.51 R13.P$6
  Top 0.406: R13.P$6 R13.P$8
N$18
  Top 0.457: MR1.P$2 MR2.P$2 18.02,35.86 U2.6
N$19  (via drill 0.3)
  Top 0.305: U1.4 63.68,43.79 62.23,43.79 v61.47,43.03
  Bottom 0.254: 57.28,61.32 57.28,62.84 J3.P$2
  Bottom 0.305: v61.47,43.03 59.82,44.68 59.82,49 58.93,49.89 58.93,52.68 57.28,54.33 57.28,61.32
N$20
  Top 0.457: MR2.P$1 18.02,35.21 U2.7 20.01,35.21 | MR3.P$2 20.51,34.71 20.01,35.21 | 20.01,35.21 21.14,36.34 MR6.P$1 MR11.P$1
N$21
  Top 0.381: U2.3 24.33,35.86 25.27,36.8 MR5.P$1 | MR12.P$1 25.59,38.72 25.59,38.71
  Top 0.406: MR5.P$1 25.59,38.38 25.59,38.71 C18.P$2
N$22
  Top 0.254: U4.14 66.29,87.72 R25.P$1
N$23
  Top 0.254: 23.81,34.47 U2.1
  Top 0.381: 23.88,33.31 23.81,33.25
  Top 0.406: 27.11,33.31 MC1.P$2
  Top 0.457: MR9.P$2 23.81,33.25 23.81,34.47 | 23.88,33.31 MR4.P$1 27.11,33.31
N$24
  pour Top (isolate 0.254, no thermals): 100.58,40.87 96.27,45.19 95,45.19 95,34.52 96.27,34.52 100.58,38.84
N$25
  Top 0.381: MR4.P$2
  Top 0.406: 27.11,35.21 MC1.P$1
  Top 0.457: MR3.P$1 22.41,34.71 22.91,35.21 U2.2 MR4.P$2 | MR4.P$2 27.11,35.21
N$26
  Top 0.762: 98.55,14.45 R6.P$2
  Top 1.651: IC1.1 98.55,14.45
N$27  (via drill 0.3)
  Top 0.305: U1.5 63.09,43.12 v62.74,42.77
  Bottom 0.254: 61.09,51.79 59.79,53.09 59.79,63.58 60.56,64.35 J3.P$4
  Bottom 0.305: v62.74,42.77 61.09,44.42 61.09,51.79
N$28
  Top 0.508: R36.P$1 R37.P$2 44.59,28.56 VREFIC.2
N$29
  Top 0.406: U3.5 34.97,34.04 R15.P$1
N$30
  pour Top (isolate 0.254, no thermals): 116.84,36.3 102.62,36.3 102.62,43.41 116.84,43.41
N$31  (via drill 0.3)
  Top 0.305: U1.6 64.07,42.07 v63.63,41.63
  Bottom 0.254: 62.99,52.43 61.8,53.62 61.8,63.37 62.77,64.35 J3.P$6
  Bottom 0.305: v63.63,41.63 63.88,41.88 63.88,43.79 62.36,45.31 62.36,49 62.99,49.63 62.99,52.43
N$32
  pour Top (isolate 0.254, no thermals): 116.84,10.9 101.6,10.9 101.6,15.98 101.09,16.48 100.33,16.48 100.33,18.01 116.84,18.01
N$34  (via drill 0.3)
  Top 0.305: U1.8 66.04,40.61 v66.55,40.11
  Bottom 0.254: J3.P$8 64.79,64.15 63.78,63.14 63.78,56.21 68.71,51.28
  Bottom 0.305: v66.55,40.11 68.45,40.11 68.71,40.36 68.71,51.28
N$35
  Top 0.457: R20.P$2 JP4.2
N$36
  Top 0.406: BUF.4 41.43,57.93 CL4.P$1
  Top 0.508: CR4.P$1 41.66,55.92 41.66,56.87 41.39,57.14 CL4.P$1 41.28,58 41.28,58.65 40.89,59.03 36.2,59.03 35.56,59.66 F4.P$1
N$37
  Top 0.406: CL3.P$1 47.5,60.16 BUF.8
  Top 0.508: CL3.P$1 48.25,60.95 48.51,60.68 49.46,60.68 CR3.P$1 F3.P$1
N$38
  Top 0.406: R17.P$2 R18.P$1 32.72,66.58 FFWD.6
N$39  (via drill 0.3)
  Top 0.305: U1.9 66.69,41.23 67.18,40.74 v69.47,40.74
  Bottom 0.254: J3.P$10 66.79,64.3 65.79,63.3 65.79,55.6 70.61,50.77
  Bottom 0.305: v69.47,40.74 69.72,41 69.72,42.77 70.61,43.66 70.61,50.77
N$40
  Top 0.381: IC3.3 R9.P$2 R9.P$4
N$41  (via drill 0.3)
  Top 0.305: U1.10 67.53,42.27 v70.61,42.27
  Bottom 0.254: 72.39,51.79 67.79,56.39 67.79,63.2 68.79,64.19 J3.P$12
  Bottom 0.305: v70.61,42.27 71.25,42.9 71.25,47.22 72.39,48.36 72.39,51.79
N$42
  Top 0.381: IC3.5 R10.P$1 R10.P$3
N$43  (via drill 0.3)
  Top 0.305: U1.11 71.53,43.12 v72.14,42.52
  Bottom 0.254: 73.02,52.68 69.77,55.93 69.77,63.2 70.79,64.21 J3.P$14
  Bottom 0.305: v72.14,42.52 73.02,43.41 73.02,52.68
N$44  (via drill 0.3)
  Top 0.305: U1.12 73.39,43.77 v73.91,43.79
  Bottom 0.254: 73.91,58.39 74.42,58.9 74.42,63.22 73.3,64.35 J3.P$16
  Bottom 0.305: v73.91,43.79 73.91,58.39
N$45
  Top 0.305: U1.14 C2.P$1
N$47
  Top 0.381: IC3.6 72.14,24.23 72.47,24.56 R10.P$5 R10.P$7
N$48  (via drill 0.3)
  Top 0.61: 34.93,33.88 R15.P$2 34.93,31.85 | C9.P$2 34.93,31.85 | 34.93,31.85 R50.P$1 | v34.04,31.85 34.93,31.85
  Bottom 0.508: C9.P$2 v34.04,31.85
N$49
  Top 0.381: IC3.10 R11.P$2 R11.P$4
N$51
  Top 0.381: IC3.14 IC3.13
RESET  (via drill 0.3)
  Top 0.254: IC5.29 116.22,81.15 | 116.22,81.15 118.36,83.29 118.36,86.59 118.62,86.84 121.41,86.84 121.92,87.35 121.92,90.14 122.43,90.65 C28.P$2 125.22,90.64 R100.P$1 125.11,88.87 | v116.33,81.25 116.33,81.04 116.22,81.15
  Route15 0.254: SV1.5 115.82,59.92 114.55,61.19 114.55,75.41 116.33,77.19 v116.33,81.25
RXI  (via drill 0.3)
  Top 0.254: IC5.30 115.25,81.95 v115.82,82.52
  Route15 0.254: v115.82,82.52 118.87,85.57 JP1.4
SCK  (via drill 0.3)
  Top 0.254: U4.11 68.7,83.41 v69.34,84.05 | 105.03,76.81 105.16,76.68 106.95,76.68 IC5.17 | 105.03,76.81 100.84,81 86.11,81 v85.34,80.24 | v104.39,76.17 105.03,76.81
  Route15 0.254: SV1.3 113.28,59.92 112.14,61.06 109.73,61.06 104.39,66.4 v104.39,76.17
  Bottom 0.254: v85.34,80.24 85.22,80.11 73.28,80.11 v69.34,84.05
SCL
  Top 0.254: IC5.28 122.07,80.35 126.24,76.17 142.75,76.17 148.08,70.84 148.08,57.89 J1.C14
SDA
  Top 0.254: IC5.27 121.6,79.55 125.73,75.41 141.99,75.41 146.56,70.84 146.56,56.87 148.34,55.09 153.42,55.09 J1.A14
SW  (via drill 0.3)
  Top 0.254: v112.39,83.54 112.78,83.93 IC5.1
  Route15 0.254: ENC.7 80.14,77.57 84.58,77.57 87.12,80.11 102.36,80.11 105.79,83.54 v112.39,83.54
TXO  (via drill 0.3)
  Top 0.254: IC5.31 115.03,82.75 v116.08,83.79
  Route15 0.254: v116.08,83.79 118.49,86.21 130.68,86.21 132.59,88.11 JP1.5
V+  (via drill 0.3)
  Top 0.406: IC4.3 124.91,81.19 125.22,81.51 125.22,82.78 124.91,83.09 IC4.1 | R19.P$2 122.57,66.15 v122.68,66.27
  Top 0.508: CD1.P$1 77.23,23.35 77.72,23.85 81.15,23.85 v81.66,24.36 | IC4.1 122.88,83.09 v122.68,83.29
  Top 0.61: IC3.4 CD1.P$1 | C29.P$1 29.73,19.91 30.23,19.91 F9.P$1 33.53,19.91
  Top 1.016: v81.66,24.36 83.06,24.36 83.18,24.49 | 33.53,19.91 v34.29,19.91 | F3.P$2 49.53,56.87 v50.04,56.36 | v76.71,47.73 76.96,47.73 | v100.33,24.61 100.33,24.87 99.57,25.63
  Route15 1.016: v50.04,56.36 74.93,56.36 76.71,54.58 v76.71,47.73
  Bottom 1.016: v81.66,24.36 81.66,20.17 79.76,18.26 48.01,18.26 | v34.29,19.91 35.94,18.26 48.01,18.26 | VREFIC.3 48.01,18.26 | v122.68,83.29 v122.68,66.27 122.68,35.03 120.14,32.49 108.2,32.49 v100.33,24.61
  pour Top (isolate 0.254, no thermals): 67.06,45.44 67.06,47.22 72.39,47.22 73.66,48.74 76.45,48.74 76.45,45.69 69.09,45.69 68.83,45.44
  pour Top (isolate 0.254, no thermals): 94.23,19.02 99.82,19.02 100.33,19.53 102.62,19.53 102.62,23.34 102.62,25.12 99.57,28.17 80.77,28.17 80.77,23.6 92.96,23.6 94.23,22.33
  pour Top (isolate 0.254, no thermals): 80.77,23.6 77.47,23.6 77.47,26.14 75.44,28.17 75.44,48.74 79.76,48.74 79.76,28.68 80.26,28.17 80.77,28.17
V-  (via drill 0.3)
  Top 0.406: R22.P$1 v115.82,66.78 | v104.39,32.23 104.14,32.23
  Top 0.508: R37.P$1 40.8,27.03 45.34,27.03 46.74,28.42 46.74,30.71 VREFIC.4
  Top 0.61: IC3.11 62.24,21.69 CD2.P$1 | F7.P$1 C24.P$1
  Top 1.016: C24.P$1 32.52,59.68 34.29,61.44 F4.P$2 36.95,61.43 v36.96,61.44 | v81.53,35.41 82.3,35.41 | CD2.P$1 v60.46,21.43 v60.45,21.44 | v81.91,33.5 82.3,33.12
  Route15 1.016: v36.96,61.44 49.91,61.44 53.09,58.27 75.56,58.27 78.49,55.35 78.49,37.95 81.03,35.41 v81.53,35.41
  Bottom 0.406: v115.82,66.78 116.08,66.78 117.86,65 117.86,36.04 116.33,34.52 107.19,34.52 104.9,32.23 v104.39,32.23
  Bottom 1.016: VREFIC.4 48.9,31.98 53.34,27.53 69.34,27.53 69.6,27.79 | v81.91,33.5 75.56,33.5 69.6,27.79 | 69.6,27.79 69.6,22.83 68.45,21.69 60.71,21.69 v60.45,21.44
  pour Top (isolate 0.254, no thermals): 104.9,34.26 104.9,31.72 102.62,29.44 80.77,29.44 80.77,38.07 83.57,38.07 83.57,33.76 84.07,33.25 100.33,33.25 101.6,34.52 104.9,34.52
VCC  (via drill 0.3)
  Top 0.254: 126.65,85.83 D2.C
  Top 0.406: IC5.18 107.98,75.44 107.7,75.16 v106.17,75.16
  Top 0.508: IC6.1 68.33,92.12 v68.33,91.92 | IC5.6 108.78,86.66 v108.97,86.84 | IC5.4 110.38,86.73 v110.49,86.84 | R100.P$2 125.22,86.59 125.98,85.83 126.65,85.83 | 126.63,85.55 126.63,85.7 D2.C | D4.C 126.71,83.03 IC4.5 | SV1.2 110.76,62.34 R23.P$2
  Top 1.016: IC4.5 126.63,83.11 C19.P$1 | 126.63,85.55 C19.P$1 | C19.P$1 125.35,84.43 v125.22,84.56
  Bottom 0.508: v68.33,91.92 68.07,91.92 | ENC.1 78.74,86.46 78.74,88.37
  Bottom 1.016: v125.22,84.56 123.95,84.56 121.67,86.84 v110.49,86.84 v108.97,86.84 107.44,88.37 106.17,88.37 | 106.17,88.37 78.74,88.37 77.72,88.37 74.17,91.92 68.07,91.92 | SV1.2 106.17,66.9 v106.17,75.16 106.17,88.37
VNEG_QUIET  (via drill 0.3)
  Top 0.254: 23.75,36.53 U2.4 | 27.43,54.71 v27.18,54.71
  Top 0.406: 23.75,36.53 CL6.P$1 | U3.4 33.94,40.34 CL2.P$1 | FFWD.4 27.2,65.14 C33.P$2
  Top 0.508: CL6.P$1 23.75,37.82 24,38.07 24.58,38.07 24.51,38.01 v24.64,37.95 | F7.P$2 26.67,56.49 27.43,55.73 | C25.P$1 27.43,55.22 | 27.43,54.71 27.43,54.46 | C26.P$1 32,55.22 | v32.26,54.71 32,54.71 | CL2.P$1 33.9,40.36 v32.77,40.36
  Top 0.762: 32,54.46 31.75,53.95 31.24,53.44 28.19,53.44 27.69,53.95 v27.18,54.71 | 32,55.73 v32.26,55.73
  Top 1.016: C33.P$2 v25.29,65.11 v25.27,65.13
  Top 1.143: 27.43,55.73 27.43,55.22 27.43,54.71 | 32,54.46 32,54.71 32,55.22 32,55.73
  Bottom 0.508: v24.64,37.95 24.64,37.57 | v32.77,40.36 32.51,40.11 32.26,40.11
  Bottom 1.016: v25.27,65.13 25.27,56.74 26.29,55.73 v27.18,55.73
  pour Bottom (isolate 0.254): 35.31,37.82 35.31,41.38 33.02,43.66 33.02,56.36 32.77,56.62 25.15,56.62 25.15,42.14 22.61,39.6 22.61,36.04 29.97,36.04 31.75,37.82
VPOS_QUIET  (via drill 0.3)
  Top 0.254: U2.8 19.1,34.46
  Top 0.406: CL5.P$1 19.1,34.46 | U3.8 37.94,35.81 CL1.P$1 | FFWD.8 31.73,68.65 C32.P$1
  Top 0.508: F9.P$2 32.77,23.34 v32.26,23.85 32,24.1 31.75,24.1 31.64,24.21 C31.P$1 | v27.18,23.85 27.29,23.85 C30.P$1 | CL5.P$1 17.82,33.54 v17.78,33.5 | CL1.P$1 39.1,35.78 v39.12,35.79
  Top 0.762: v32.26,24.87 32.26,25.63 31.75,26.14 27.94,26.14 27.18,25.37 v27.18,24.87
  Top 1.016: C32.P$1 31.75,68.69 v31.75,70.08
  Top 1.143: v32.26,23.85 v32.26,24.87 | v27.18,23.85 v27.18,24.87
  Bottom 0.508: v17.78,33.5 17.78,32.99 17.53,32.74 | v39.12,35.79 39.12,36.04 39.37,36.3
  Bottom 1.016: v31.75,70.08 31.75,68.17 34.54,65.38 34.54,45.31 38.23,41.63 38.23,36.17 38.61,35.79 v39.12,35.79
  pour Bottom (isolate 0.254): 31.24,34.77 18.03,34.77 16.26,32.99 16.26,24.61 17.53,23.34 34.54,23.34 36.32,25.12 36.32,34.01 37.34,35.03 39.88,35.03 39.88,36.55 33.02,36.55
VREF
  Top 0.508: R12.P$1 R36.P$2 36.97,30.09 36.58,29.69 34.94,29.69 R50.P$2
VREG  (via drill 0.3)
  Top 0.305: U1.3 62.87,44.42
  Top 0.406: R13.P$5 48.34,54.51 49.44,53.4 RS1.2
  Top 0.508: C10.P$1 53.1,34.54 F8.P$1 v52.2,31.6 | RS2.2 50.04,46.29 50.04,46.46 51.05,45.44 59.94,45.44 60.96,44.42 62.87,44.42 | R12.P$2 v40.77,32.61
  Top 0.762: C8.P$1 v42.29,43.15 | C7.P$1 v45.09,43.15 | C3.P$1 40.37,41.13 v40.39,41.12 | v39.62,31.85 C9.P$1
  Top 1.27: 49.53,47.22 49.78,47.47 51.31,47.47
  Top 1.778: RS2.2 RS1.2 49.44,47.3 49.53,47.22
  Route15 0.508: v52.2,31.6 52.2,31.72 51.82,32.11
  Route15 0.762: v40.39,41.12 40.39,40.87 | v40.77,32.61 41.66,32.23
  Bottom 0.762: C8.P$1 C7.P$1 v45.09,43.15 | v42.29,43.15 42.29,41.88 42.16,41.88 | C9.P$1 v39.62,31.85
  other vias: 56.64,46.71 54.1,46.71 52.83,46.71 55.37,46.71 51.56,46.71 57.91,46.71 59.18,46.71 60.45,46.71 61.72,46.71 63.75,47.73 62.99,46.71 51.94,33.38 51.94,34.52 51.94,35.66
  pour Top (isolate 0.254, no thermals): 64.77,45.44 63.25,45.44 62.48,46.2 49.78,46.2 49.78,48.49 63.75,48.49 64.77,47.47
  pour Route15 (isolate 0.254): 37.85,45.69 37.85,30.96 53.59,30.96 53.59,45.44 64.26,45.44 65.02,46.2 65.02,47.47 63.75,48.74 48.51,48.74 45.47,45.69
VREG_DAC  (via drill 0.3)
  Top 0.508: C11.P$1 57.15,32.21 v57.15,32.11 56.64,31.6 F8.P$2 | v57.15,37.19 57.15,37.08 C21.P$1 | 59.44,34.14 59.7,33.87 C22.P$1 62.37,34.01 DAC1.3 | 59.31,37.06 60.2,37.95 C23.P$1 69.86,36.6 DAC1.8
  Top 0.762: v58.17,32.11 59.18,32.11 59.44,32.36 59.44,34.14 59.44,36.93 59.31,37.06 59.18,37.19 v58.17,37.19
  Top 1.143: v57.15,32.11 v58.17,32.11 | v57.15,37.19 v58.17,37.19
VREG_EN  (via drill 0.3)
  Top 0.254: v74.68,44.68 72.9,44.68 72.52,44.3 69.21,44.3 69.09,44.42 U1.13 | IC5.2 111.98,84.14 110.24,82.4 v110.24,81.89
  Route15 0.254: v110.24,81.89 107.95,81.89 105.41,79.35 v100.2,79.35
  Bottom 0.254: v74.68,44.68 77.22,44.68 80.52,47.98 80.52,75.67 81.53,76.68 84.96,76.68 87.5,79.22 100.08,79.22 v100.2,79.35
VSET  (via drill 0.3)
  Top 0.508: DAC1.1 v62.48,36.55 | v55.12,38.58 R4.P$2
  Route15 0.508: v62.48,36.55 62.36,36.55 62.36,37.57 61.34,38.58 v55.12,38.58
VSS  (via drill 0.3)
  Top 0.254: U4.15 65.79,83.79 66.04,83.79 U4.P$17
  other vias: 69.85,76.05 66.04,83.16 63.12,86.46 49.78,91.67 60.2,92.3 60.71,90.78 65.15,89.76 99.19,92.56 102.11,92.56 106.17,92.43 113.66,92.43 117.86,92.43 120.52,92.43 121.67,91.29 121.67,84.56 119,77.83 119,75.92 120.27,74.14 118.49,69.19 120.52,69.19 115.7,70.46 102.11,71.6 100.96,73.13 100.84,76.3 98.42,77.83 98.42,70.21 98.42,85.06 106.3,89.89 112.78,89.89 119,88.49 116.71,91.03 120.27,82.52 121.41,76.94 118.36,71.6 103.25,70.46 98.42,72.87 118.87,65.13 115.82,68.43 129.29,84.43 135.13,95.86 135,93.95 136.02,92.81 128.14,87.22 112.14,81.89 108.58,80.62 107.7,82.78 108.84,72.36 64.01,95.35 48.26,78.33 63.5,74.65 71.25,86.33 72.52,90.02 86.23,93.95 90.68,85.83 90.93,76.3 128.4,77.32 125.6,68.55 119.89,61.32 105.16,60.3
  pour Top (isolate 0.254): 45.47,100.81 45.47,72.87 91.19,72.87 96.27,67.79 96.27,57.63 126.75,57.63 129.29,60.17 129.29,72.87 131.83,75.41 136.91,75.41 136.91,100.81
  pour Route2 (isolate 0.254): 45.47,100.81 45.47,72.87 91.19,72.87 96.27,67.79 96.27,57.63 126.75,57.63 129.29,60.17 129.29,72.87 131.83,75.41 136.91,75.41 136.91,98.27 136.91,100.81
  pour Route15 (isolate 0.254): 45.47,100.81 45.47,72.87 91.19,72.87 96.27,67.79 96.27,57.63 126.75,57.63 129.29,60.17 129.29,72.87 131.83,75.41 136.91,75.41 136.91,100.81
  pour Bottom (isolate 0.254): 45.47,100.81 45.47,72.87 91.19,72.87 96.27,67.79 96.27,57.63 126.75,57.63 129.29,60.17 129.29,72.87 131.83,75.41 136.91,75.41 136.91,100.81

## Text on the board
tPlace: Current Controller | DTR | TX | git.io/v9c60 / tag: v2.1 | RX | VUSB | Feed Forward | Disabled | FTDI Header | Enabled | GPIO # 0 | # 1 | # 2 | Vreg = 1.4V + | # 3 | # 4 | # 5 | # 6 | Feed Forward / backplane select | # 7 | 6.4V | 6.4V | 3.2V | 1.6V | 0.8V | 0.4V | 0.2V | 0.1V | ISP Prog | FFWD | VNEG_QUIET | short | C12-15 | VPOS_QUIET | DCS | DDATA | DCLK | Jumper for / 50-ohm term